# Altium schematic sheet [10] - USB.SchDoc
size A3; DocumentNumber: 10; SheetNumber: 10; SheetTotal: 18
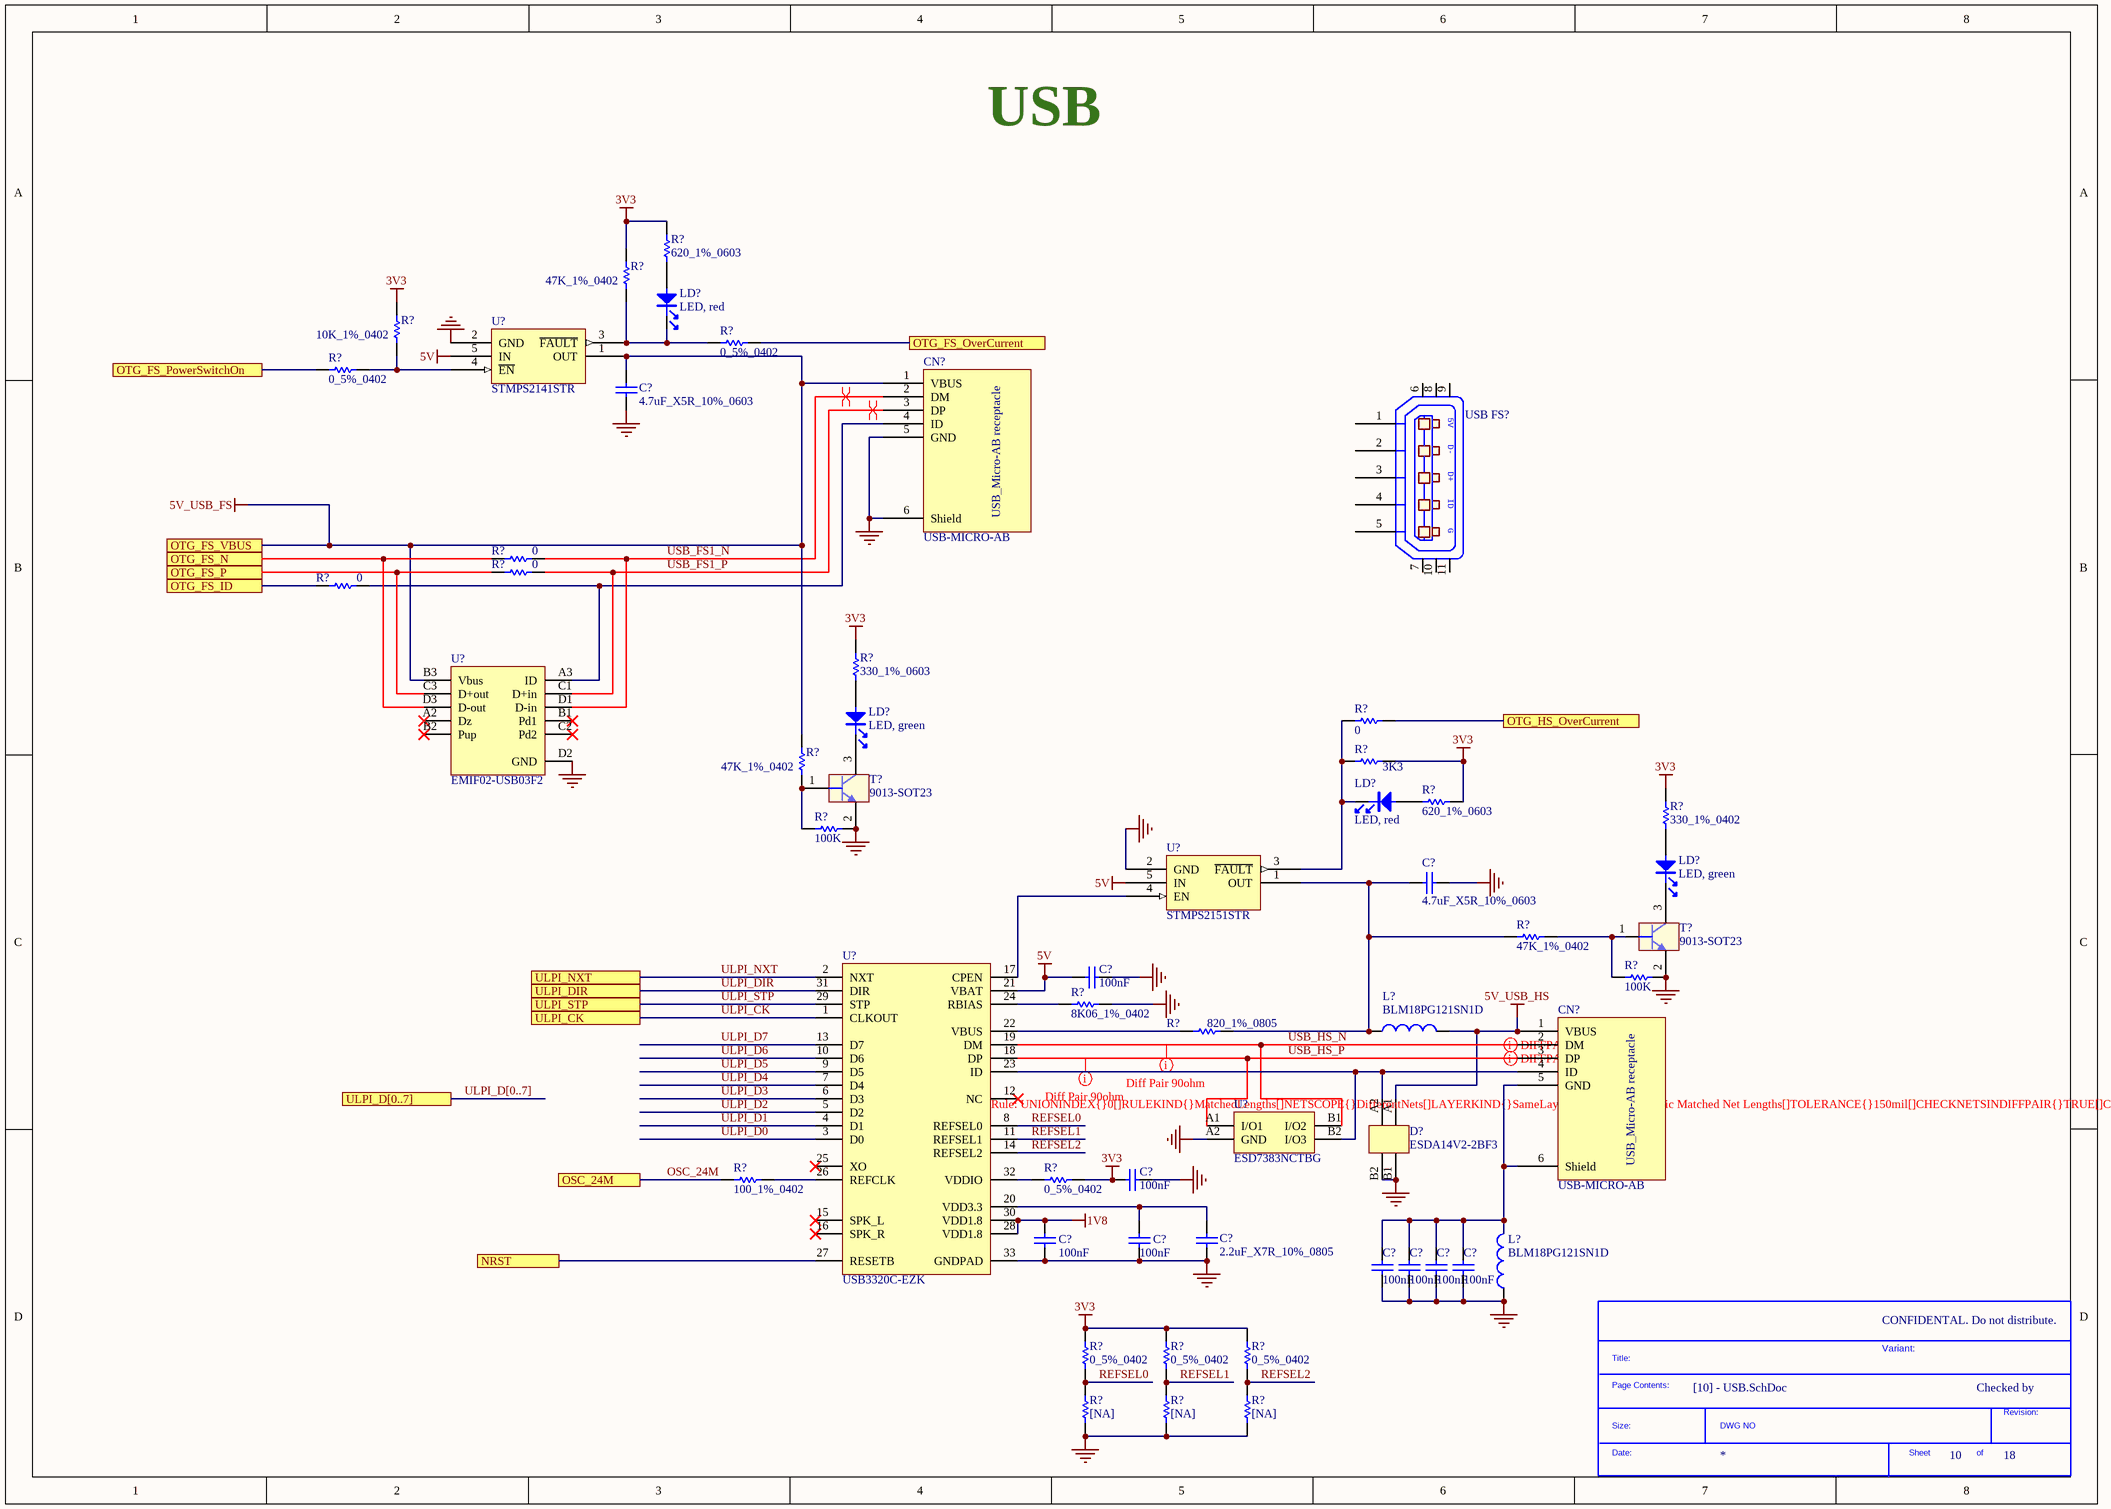
[diagram p0: [10] - USB.SchDoc]

## Parts
(Parts that share a designator on the sheet are numbered #1, #2 ... from top to bottom, then left to right.)
*  SDTitleBlock  (value not drawn)  (graphical)
C?#1  4.7uF_X5R_10%_0603  [0603C]
C?#2  4.7uF_X5R_10%_0603  [0603C]
C?#3  100nF  [0402C]
C?#4  100nF  [0402C]
C?#5  100nF  [0402C]
C?#6  100nF  [0402C]
C?#7  2.2uF_X7R_10%_0805  [0805C]
C?#8  100nF  [0402C]
C?#9  100nF  [0402C]
C?#10  100nF  [0402C]
C?#11  100nF  [0402C]
CN?#1  USB-MICRO-AB  [USB-MICRO-AB]
CN?#2  USB-MICRO-AB  [USB-MICRO-AB]
D?  ESDA14V2-2BF3  [BGA4_1X1]
L?#1  BLM18PG121SN1D  [0603L]
L?#2  BLM18PG121SN1D  [0603L]
LD?#1  LED, red  [0603D]
LD?#2  LED, green  [0603D]
LD?#3  LED, red  [0603D]
LD?#4  LED, green  [0603D]
R?#1  620_1%_0603  [0603R]
R?#2  47K_1%_0402  [0402R]
R?#3  0_5%_0402  [0402R]
R?#4  10K_1%_0402  [0402R]
R?#5  0_5%_0402  [0402R]
R?#6  0  [0402R]
R?#7  0  [0402R]
R?#8  0  [0402R]
R?#9  330_1%_0603  [0603R]
R?#10  0  [0402R]
R?#11  47K_1%_0402  [0402R]
R?#12  3K3  [0402R]
R?#13  620_1%_0603  [0603R]
R?#14  100K  [0402R]
R?#15  330_1%_0402  [0402R]
R?#16  47K_1%_0402  [0402R]
R?#17  100K  [0402R]
R?#18  8K06_1%_0402  [0402R]
R?#19  820_1%_0805  [0805R]
R?#20  100_1%_0402  [0402R]
R?#21  0_5%_0402  [0402R]
R?#22  0_5%_0402  [0402R]
R?#23  0_5%_0402  [0402R]
R?#24  0_5%_0402  [0402R]
R?#25  [NA]  [0402R]
R?#26  [NA]  [0402R]
R?#27  [NA]  [0402R]
T?#1  9013-SOT23  [SOT23]
T?#2  9013-SOT23  [SOT23]
U?#1  STMPS2141STR  [SOT23-5L]
U?#2  EMIF02-USB03F2  [Flip Chip]
U?#3  STMPS2151STR  [SOT23-5L]
U?#4  USB3320C-EZK  [QFN32_0R5_5X5]
U?#5  ESD7383NCTBG  [ESD_WLCSP4_CASE-567CB_0P80X0P80_P040]
USB_FS?  USB MICRO AB  [USB_Micro_AB]  (value not drawn)

## Ports
NRST, OSC_24M, OTG_FS_ID, OTG_FS_N, OTG_FS_OverCurrent, OTG_FS_P, OTG_FS_PowerSwitchOn, OTG_FS_VBUS, OTG_HS_OverCurrent, ULPI_CK, ULPI_D[0..7], ULPI_DIR, ULPI_NXT, ULPI_STP

## Nets
1V8: C?#5.2 U?#4.28(VDD1.8) U?#4.30(VDD1.8)
3V3: C?#4.1 R?#1.2 R?#2.2 R?#4.2 R?#9.2 R?#12.1 R?#13.2 R?#15.2 R?#21.2 R?#22.2 R?#23.2 R?#24.2
5V: C?#3.1 U?#1.5(IN) U?#3.5(IN) U?#4.21(VBAT)
5V_USB_FS: C?#1.2 CN?#1.1(VBUS) R?#11.2 U?#1.1(OUT) U?#2.B3(Vbus) ; port OTG_FS_VBUS
5V_USB_HS: CN?#2.1(VBUS) D?.A1 L?#1.2
GND: C?#1.1 C?#2.2 C?#3.2 C?#4.2 C?#5.1 C?#6.1 C?#7.1 C?#8.1 C?#9.1 C?#10.1 C?#11.1 CN?#1.5(GND) CN?#1.6(Shield) D?.B1 D?.B2 L?#2.1 R?#14.2 R?#17.2 R?#18.2 R?#25.1 R?#26.1 R?#27.1 T?#1.2(E) T?#2.2(E) U?#1.2(GND) U?#2.D2(GND) U?#3.2(GND) U?#4.33(GNDPAD) U?#5.A2(GND)
NRST: U?#4.27(RESETB) ; port NRST
OSC_24M: R?#20.1 ; port OSC_24M
OTG_FS_ID: R?#8.1 ; port OTG_FS_ID
OTG_FS_N: R?#6.1 U?#2.D3(D-out) ; port OTG_FS_N
OTG_FS_OverCurrent: R?#3.2 ; port OTG_FS_OverCurrent
OTG_FS_P: R?#7.1 U?#2.C3(D+out) ; port OTG_FS_P
OTG_FS_PowerSwitchOn: R?#5.1 ; port OTG_FS_PowerSwitchOn
OTG_HS_OverCurrent: R?#10.2 ; port OTG_HS_OverCurrent
REFSEL0: R?#22.1 R?#25.2 U?#4.8(REFSEL0)
REFSEL1: R?#23.1 R?#26.2 U?#4.11(REFSEL1)
REFSEL2: R?#24.1 R?#27.2 U?#4.14(REFSEL2)
ULPI_CK: U?#4.1(CLKOUT) ; port ULPI_CK
ULPI_D0: U?#4.3(D0)
ULPI_D1: U?#4.4(D1)
ULPI_D2: U?#4.5(D2)
ULPI_D3: U?#4.6(D3)
ULPI_D4: U?#4.7(D4)
ULPI_D5: U?#4.9(D5)
ULPI_D6: U?#4.10(D6)
ULPI_D7: U?#4.13(D7)
ULPI_DIR: U?#4.31(DIR) ; port ULPI_DIR
ULPI_NXT: U?#4.2(NXT) ; port ULPI_NXT
ULPI_STP: U?#4.29(STP) ; port ULPI_STP
USB_FS1_N: CN?#1.2(DM) R?#6.2 U?#2.D1(D-in)
USB_FS1_P: CN?#1.3(DP) R?#7.2 U?#2.C1(D+in)
USB_HS_N: CN?#2.2(DM) U?#4.19(DM) U?#5.B1(I/O2)
USB_HS_P: CN?#2.3(DP) U?#4.18(DP) U?#5.A1(I/O1)
NetC?#2_1: C?#2.1 L?#1.1 R?#16.1 R?#19.2 U?#3.1(OUT)
NetC?#6_2: C?#6.2 C?#7.2 U?#4.20(VDD3.3)
NetC?#8_2: C?#8.2 C?#9.2 C?#10.2 C?#11.2 CN?#2.5(GND) CN?#2.6(Shield) L?#2.2
NetCN?#1_4: CN?#1.4(ID) R?#8.2 U?#2.A3(ID)
NetCN?#2_4: CN?#2.4(ID) D?.A2 U?#4.23(ID) U?#5.B2(I/O3)
NetLD?#1_1: LD?#1.1 R?#1.1
NetLD?#1_2: LD?#1.2 R?#2.1 R?#3.1 U?#1.3(~{FAULT})
NetLD?#2_1: LD?#2.1 R?#9.1
NetLD?#2_2: LD?#2.2 T?#1.3(C)
NetLD?#3_1: LD?#3.1 R?#13.1
NetLD?#3_2: LD?#3.2 R?#10.1 R?#12.2 U?#3.3(~{FAULT})
NetLD?#4_1: LD?#4.1 R?#15.1
NetLD?#4_2: LD?#4.2 T?#2.3(C)
NetR?#4_1: R?#4.1 R?#5.2 U?#1.4(~{EN})
NetR?#11_1: R?#11.1 R?#14.1 T?#1.1(B)
NetR?#16_2: R?#16.2 R?#17.1 T?#2.1(B)
NetR?#18_1: R?#18.1 U?#4.24(RBIAS)
NetR?#19_1: R?#19.1 U?#4.22(VBUS)
NetR?#20_2: R?#20.2 U?#4.26(REFCLK)
NetR?#21_1: R?#21.1 U?#4.32(VDDIO)
NetU?#3_4: U?#3.4(EN) U?#4.17(CPEN)

Not connected (* = marked no-connect by the designer): U?#2 A2(Dz)* B1(Pd1)* B2(Pup)* C2(Pd2)*; U?#4 12(NC)* 15(SPK_L)* 16(SPK_R)* 25(XO)*; USB_FS? 1(P1) 2(P2) 3(P3) 4(P4) 5(P5) 6 7 8 9 10 11

## Buses and harness runs
bus ULPI_D[0..7] = port ULPI_D[0..7]

## Layout directives
differential pair: USB_FS1_N, USB_FS1_P, USB_HS_N, USB_HS_P
rule Matched Net Lengths [Tolerance = 150mil]: USB_HS_N, USB_HS_P

## Notes on the sheet
- USB
- CONFIDENTAL. Do not distribute.
- CLOCKS (CPU & PCIE)
- Variant:
- Checked by
- (in symbol 0475890001) 5V; D-; D+; ID; G
- (in symbol SDTitleBlock) Title:; Page Contents:; Revision:; Size:; DWG NO; Date:; Sheet; of
- (in symbol USB-MICRO-AB) USB_Micro-AB receptacle

## Library data of the parts
C?#1 C?#2 = Cap_4.7uF_X5R_10%_0603: Capacitor,4.7uF,16V, X5R,10%,0603,YAGEO; Manuf_Part_1: CC0603KRX5R7BB475; Order: CC0603KRX5R7BB105; Revision: July-2002: Re-released for DXP Platform.; Value: 4.7uF; Manuf_1: YAGEO; ECCN_US/EU: n/a
C?#3-C?#6 C?#8-C?#11 = Cap_100nF_X7R_10%_0402: Capacitor,100nF,16V,X7R,10%,0402,YAGEO; Manuf_Part_1: CC0402KRX7R7BB104; Revision: July-2002: Re-released for DXP Platform.; Value: 100nF; Order: CC0402KRX7R7BB104; Manuf_1: YAGEO
C?#7 = Cap_2.2uF_X7R_10%_0805: Capacitor,2.2uF,16V, X7R,10%,0805,YAGEO; Manuf_Part_1: CC0805KKX7R7BB225; Revision: July-2002: Re-released for DXP Platform.; Value: 2.2uF; Order: CC0805KKX7R7BB225; Manuf_1: YAGEO; ECCN_US/EU: n/a
CN?#1 CN?#2 = USB-MICRO-AB: USB-MICRO-AB, 47590-0001, SMT, MOLEX; Ref St: xxxxxxx; Manuf_1: MOLEX; Manuf_Part_1: 47590-0001; ECCN_US/EU: n/a; Distrib: *
D? = ESDA14V2-2BF3: Quad bidirectional Transil array for ESD protection; Manuf_1: STM; ECCN_US/EU: EAR99/NEC; Provided: ST; Ref St: 9179040; Distrib: ST; Manuf_Part_1: ESDA14V2-2BF3
L?#1 L?#2 = BEAD_120R_2A_0603: Bead,120R,2A,0603,BLM18PG121SN1D,MURATA; Manuf_Part_3: FCM1608KF-601T03; Manuf_2: TDK; Manuf_Part_2: MPZ1608S300A; Manuf_3: Tai-tech; Value: 100uH; Description_3: Bead,600R,350mA,0603,FCM1608KF-601T03,Tai-tech; Description_2: Bead,30R,5A,0603,MPZ1608S300A,TDK; Revision: July-2002: Re-released for DXP Platform.; ECCN_US/EU: n/a; Manuf_Part_1: BLM18PG121SN1D; Manuf_1: MURATA
LD?#1 LD?#3 = LED_red: LED, red, 0603; Manuf_1: everlight; Manuf_Part_1: 19-217/R6C-AL1M2VY/3T; ECCN_US/EU: EAR99/NEC; Order: 19-217/R6C-AL1M2VY/3T
LD?#2 LD?#4 = LED_green: LED, green, 0603; Manuf_1: everlight; Manuf_Part_1: 19-213SYGC/S530-E2/TR8; ECCN_US/EU: EAR99/NEC; Order: 19-213SYGC/S530-E2/TR8
R?#1 R?#13 = Res_620_1%_0603: Resistor,620,0603,1%,VISHAY; Manuf_Part_1: CRCW0603620RFKEA; Manuf_1: VISHAY DRALORIC; Value: 620; Order: 2122341; ECCN_US/EU: n/a; Distrib: FARNELL
R?#2 R?#11 R?#16 = Res_47K_1%_0402: Resistor,47K,0402,1%,YAGEO; Manuf_Part_1: RC0402FR-0747KL; Order: 9239430; Value: 47K; Manuf_1: YAGEO; ECCN_US/EU: n/a; Distrib: FARNELL
R?#3 R?#5 R?#21-R?#24 = Res_0_5%_0402: Resistor,0,0402,5%,YAGEO; Manuf_Part_1: RC0402JR-070RL; Value: 0; Order: 2363467; ECCN_US/EU: n/a; Manuf_1: YAGEO; Distrib: FARNELL
R?#4 = Res_10K_1%_0402: Resistor,10K,0402,1%,YAGEO; Manuf_Part_1: RC0402FR-0710KL; Value: 10K; Manuf_1: YAGEO; Order: RC0402FR-0710KL; ECCN_US/EU: n/a
R?#6-R?#8 R?#10 = Res_0_5%_0402: Resistor,0,0402,5%,YAGEO; Manuf_Part_1: RC0402JR-070RL; Order: 2363467; Value: 0; ECCN_US/EU: n/a; Manuf_1: YAGEO; Distrib: FARNELL
R?#9 = Res_330_1%_0603: Resistor,330,0603,1%,YAGEO; Manuf_Part_1: RT0603FRE07330RL; Value: 330; Order: 1500622RL; ECCN_US/EU: n/a; Manuf_1: YAGEO; Distrib: FARNELL
R?#12 = Res_3K3_1%_0402: Resistor,3K3,0402,1%,YAGEO; Manuf_Part_1: RC0402FR-073K3L; Value: 3K3; Manuf_1: YAGEO; Order: *; ECCN_US/EU: n/a; Distrib: FARNELL
R?#14 R?#17 = Res_100K_1%_0402: Resistor,100K,0402,1%,YAGEO; Manuf_Part_1: RT0402FRE07100KL; Value: 100K; Manuf_1: YAGEO; Order: RT0402FRE07100KL; ECCN_US/EU: n/a
R?#15 = Res_330_1%_0402: Resistor,330,0402,1%,YAGEO; Manuf_Part_1: RC0402FR-07330RL; Value: 330; ECCN_US/EU: n/a; Manuf_1: YAGEO; Distrib: DIGIKEY; Order: RC0402FR-07330RL
R?#18 = Res_8K06_1%_0402: Resistor,8K06,0402,1%,YAGEO; Manuf_Part_1: RC0402FR-078K06L; Value: 8K06; Manuf_1: YAGEO; Order: RC0402FR-078K06L; ECCN_US/EU: n/a; Distrib: DIGIKEY
R?#19 = Res_820_1%_0805: Resistor,820,0805,1%,YAGEO; Manuf_Part_1: RC0805FR-07820RL; Value: 820; Manuf_1: YAGEO; Order: RC0805FR-07820RL; ECCN_US/EU: n/a
R?#20 = Res_100_1%_0402: Resistor,100,0402,1%,YAGEO; Manuf_Part_1: RC0402FR-07100RL; Value: 100; Order: 9239111; Manuf_1: YAGEO; ECCN_US/EU: n/a; Distrib: FARNELL
R?#25-R?#27 = Res_NA_0402: Resistor,[NA],0402; Fitted: NO; Value: [NA]; ECCN_US/EU: n/a
T?#1 T?#2 = 9013-SOT23: NPN Bipolar Transistor; Manuf_1: NXP; Manuf_Part_1: BSR14; Order: 1081310; ECCN_US/EU: EAR99/NEC; Revision: July-2002: Re-released for DXP Platform.; Distrib: FARNELL
U?#1 = STMPS2141STR: Enhanced single channel power switches; Manuf_1: STM; Provided: ST; ECCN_US/EU: EAR99/NEC; Ref St: 9159003; Order: STMPS2141STR; Manuf_Part_1: STMPS2141STR; Distrib: ST
U?#2 = EMIF02-USB03F2: 2-line IPAD, EMI filter including ESD protection; Manuf_1: STM; Provided: ST; ECCN_US/EU: EAR99/NEC; Ref St: 9179037; Order: EMIF02-USB03F2; Manuf_Part_1: EMIF02-USB03F2; Distrib: ST
U?#3 = STMPS2151STR: Enhanced single channel power switches; Manuf_1: STM; Provided: ST; ECCN_US/EU: EAR99/NEC; Ref St: xxxxxx; Order: STMPS2151STR; Manuf_Part_1: STMPS2151STR; Distrib: ST
U?#4 = USB3320C-EZK: USB3320C,  Hi-Speed USB Host, Device or OTG PHY with ULPI Low Pin Interface; Manuf_1: MICROCHIP; Manuf_Part_1: USB3320C-EZK-TR; Distrib: MICROCHIP; Order: USB3320C-EZK-TR; ECCN_US/EU: *
U?#5 = ESD7383NCTBG: 3-line low capacitance protection for high speed USB; Manuf_1: ON SEMICONDUCTOR; ECCN_US/EU: EAR99/NEC; provided: SUBCO; Manuf_Part_1: ESD7383NCTBG; value: ESD7383NCTBG
USB_FS? = 0475890001: CONN RCPT MICRO USB AB R/A SMD; Manufacturer: Molex Inc; Connector Type: USB - micro AB; Number of Contacts: 5; Gender: Receptacle; .Creator: MM; Supplier 1: Digi-Key; Manufacturer Part Number: 0475890001; RoHS: RoHS Compliant; Category: Connectors, Interconnects; Stock 1: 12754; Pricing 1: 1=0.81, 10=0.764, 25=0.6872, 50=0.6108, 100=0.5854, 250=0.53452, 500=0.50908 (USD); Packaging: Cut Tape (CT); Specifications: -; Mounting Type: Surface Mount, Right Angle, Horizontal; Features: Board Guide, Shielded; Ingress Protection: -; ComponentLink1URL: http://www.molex.com/pdm_docs/sd/475890001_sd.pdf; ComponentLink1Description: http://www.molex.com/pdm_docs/sd/475890001_sd.pdf; Supplier Part Number 1: WM17143CT-ND; .Checked PCB: MM; .Checked SCH: MM